# EAGLE design CoinCellBreakOut (EAGLE 7.7.0)
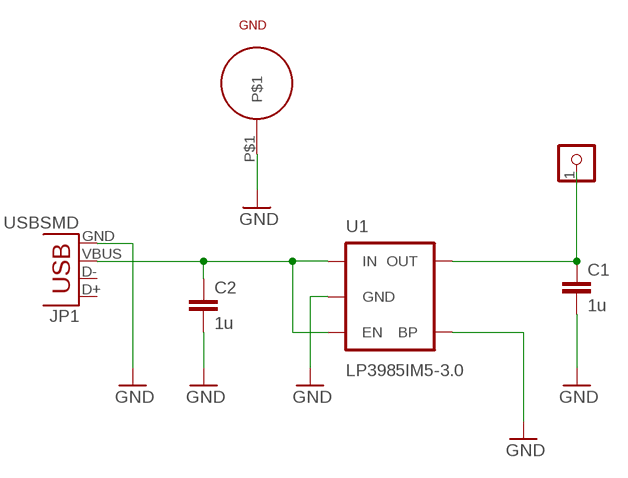
[diagram p0: schematic, sheet 1]

## Parts
3V  CON_HEADER_1X01-PTH_10_17  [M1X2_10_17]
C1  1u  CAP0603-CAP  [0603-CAP]
C2  1u  CAP0603-CAP  [0603-CAP]
GND  COIN_CELL_CONTACT  [COIN_CELL_CONTACT]
JP1  USBSMD  [USB-MINIB]
U1  LP3985IM5-3.0  V_REG_LDOSMD  [SOT23-5]

## Nets
GND [power]: C1.2 C2.2 GND.P$1 JP1.GND U1.2(GND) U1.4(BP)
N$1 [power]: C2.1 JP1.VBUS U1.1(IN) U1.3(EN)
N$5 [power]: 3V.1 C1.1 U1.5(OUT)
Unconnected: JP1.D+ JP1.D-

## Library data of the parts
3V = dp_devices:CON_HEADER_1X01
C1 C2 = SparkFun-Capacitors:CAP: Capacitor Standard 0603 ceramic capacitor, and 0.1" leaded capacitor.
GND = CoinCellBreakOut:COIN_CELL_CONTACT
JP1 = SparkFun-Connectors:USB: USB Connectors USB-B-PTH is fully proven SKU : PRT-00139/CONN-08278 USB-miniB is fully proven SKU : PRT-00587 USB-A-PCB is untested. USB-A-H is throughly reviewed, but untested. Spark Fun Electronics SKU : PRT-00437 USB-B-SMT is throughly reviewed, but untested. Needs silkscreen touching up. USB-A-S has not been used/tested USB-MB-H has not been used/tested USB-MICROB has been used. CONN-09505; PROD_ID: CONN-08193
U1 = SparkFun-PowerIC:V_REG_LDO: Voltage Regulator LDO Standard 150mA LDO voltage regulator in SOT-23 layout. Micrel part MIC5205. BP (by-pass) pin is used to lower output noise with 470pF cap.

## Net classes
0 default: width 0.254 mm, drill 0.305 mm, clearance 0.127 mm
1 power: width 0.635 mm, drill 0.635 mm, clearance 0.127 mm

## Board
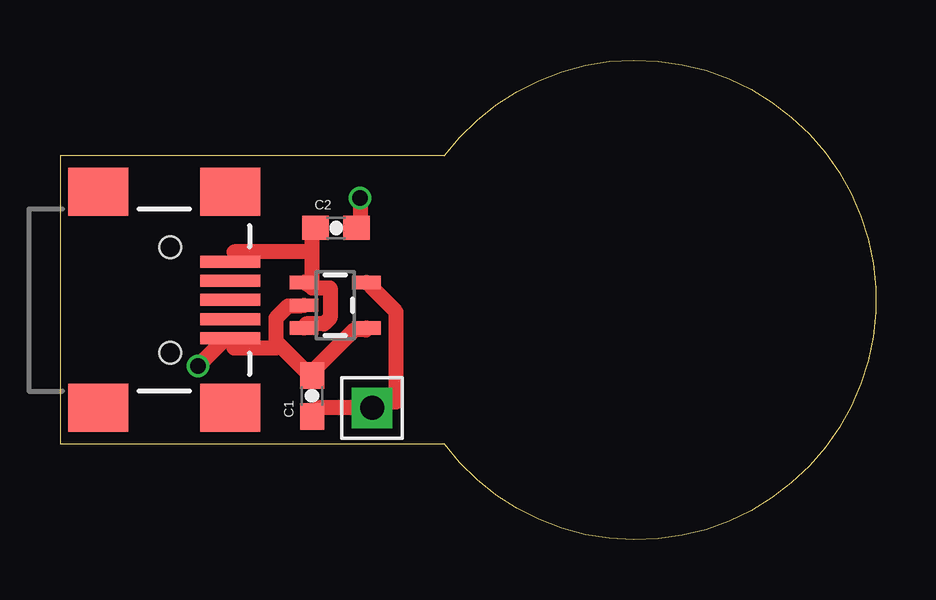
[diagram p1: board, top side]
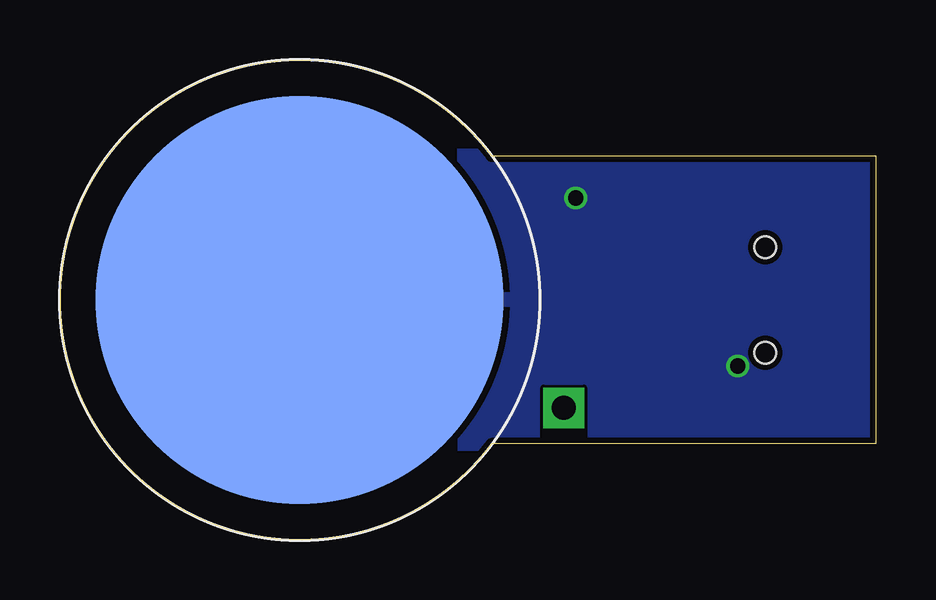
[diagram p2: board, bottom side, seen from below]

Size 33.99 x 20 mm. Coordinates in mm from the lower left corner, seen from the top.
Outline: 0,4 16,4 arc286 16,16 0,16 0,4
Copper layers (1*16): Top 0.035mm / dielectric 1.5mm / Bottom 0.035mm
Design rules "dirt_cheap_dirty_boards.v1": minimum track width 5mil, minimum drill 12mil, track to track 5mil, track to pad 5mil, pad to pad 5mil, via to via 5mil, smd to smd 0mil, copper to edge 10mil, drill to drill 10mil, minimum pad ring 10mil, minimum via ring 6mil, stop-mask expansion 2mil, vias tented up to drill 25mil, thermal gap 10mil

### Footprints (pad centres in the part's own frame; a part is rotated, then mirrored left to right if it is on the bottom)
M1X2_10_17 = drill 1 pad 1.7 square: 1 0,0
0603-CAP = smd 1.1 x 1: 1 -0.85,0; 2 0.85,0
COIN_CELL_CONTACT = smd 17 x 17: P$1 0,0
USB-MINIB = smd 2.5 x 0.5: D+ 2.5,0; D- 2.5,0.8; GND 2.5,-1.6; ID 2.5,-0.8; VBUS 2.5,1.6 | smd 2.5 x 2: MTN1 -3,4.5; MTN2 2.5,4.5; MTN3 -3,-4.5; MTN4 2.5,-4.5 | hole 0.9: 0,2.2; 0,-2.2
SOT23-5 = smd 0.55 x 1.2: 1 -0.95,-1.3; 2 0,-1.3; 3 0.95,-1.3; 4 0.95,1.3; 5 -0.95,1.3

### Placement (x,y rotation side)
3V  13,5.5 0 top
C1  10.5,6 90 top
C2  11.5,13 0 top
GND  24,10 180 bottom
JP1  4.6,10 0 top
U1  11.47,9.78 270 top

### Tracks (layer width: path | path; a pad name or v marks a point on that pad's centre or on a via)
GND  (via drill 0.64)
  Top 0.305: 7.25,8 JP1.GND 7,8.25 6.75,8.25
  Top 0.635: U1.4 12.75,8.75 12.25,8.75 10.5,7 C1.2 10.25,7 9,8.25 | v12.5,14.25 12.5,13 C2.2 | 9,8.25 9,9.25 9.5,9.75 10,9.75 U1.2 | 7.25,8 9,8 9,8.25 | 6.75,8.25 v5.75,7.25
  pour Bottom: 0,16 0,4 19.5,4 19.5,16
N$1
  Top 0.305: 7.25,12 JP1.VBUS
  Top 0.635: 10.5,12 10.5,10.75 10.25,10.75 U1.1 10.5,10.5 11.25,10.5 11.25,9.25 11,9 10.25,9 U1.3 | 10.5,12 10.5,13 C2.1 | 10.5,12 7.25,12
N$5
  Top 0.635: C1.1 10.5,5.25 10.75,5.5 3V.1 13,5.75 14,5.75 14,9.5 13,10.5 U1.5